# Altium project Mega to Connector.PrjPcb
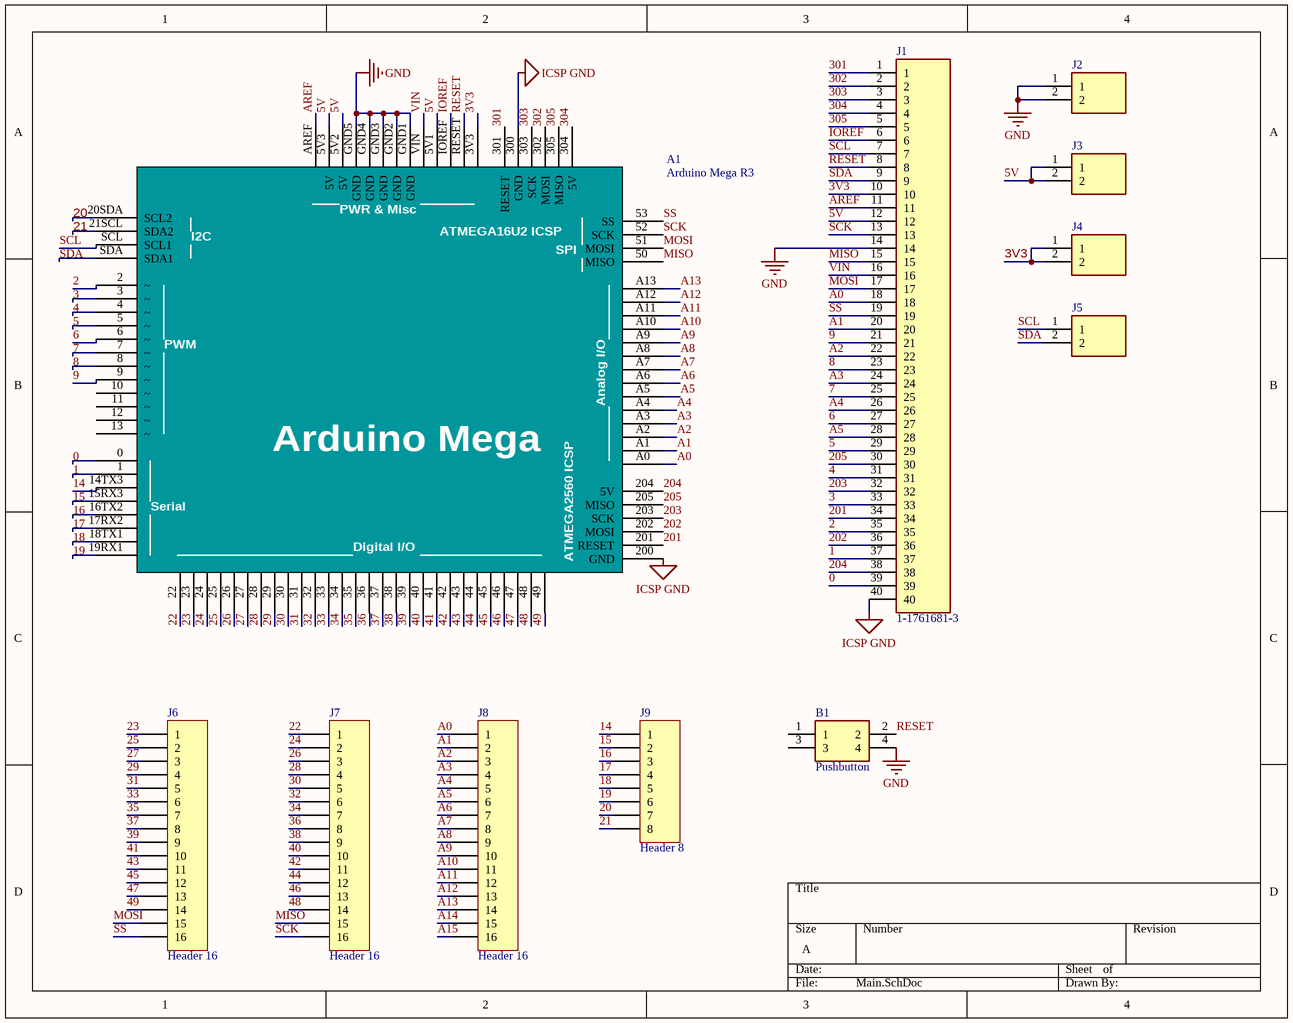
[diagram p0: Main.SchDoc]
1 sheet, 11 parts. Net scope: global (net labels, ports and power ports of the same name join across sheets).
Board file: Main.PcbDoc

## Sheet Main.SchDoc
size A; SheetNumber: 1; SheetTotal: 1

### Parts
A1  Arduino Mega R3  [Arduino Mega]
B1  Pushbutton  [FSM4JH]
J1  1-1761681-3  [TE_1-1761681-3]
J2  TB002-500-02BE  [TB00250002BE]  (value not drawn)
J3  TB002-500-02BE  [TB00250002BE]  (value not drawn)
J4  TB002-500-02BE  [TB00250002BE]  (value not drawn)
J5  TB002-500-02BE  [TB00250002BE]  (value not drawn)
J6  Header 16  [HDR1X16]
J7  Header 16  [HDR1X16]
J8  Header 16  [HDR1X16]
J9  Header 8  [HDR1X8]

### Nets
GND: A1.GND1(GND) A1.GND2(GND) A1.GND3(GND) A1.GND4(GND) A1.GND5(GND) B1.4 J1.14 J2.1 J2.2
ICSP GND: A1.200(GND) A1.300(GND) J1.40
0: A1.0 J1.39
1: A1.1 J1.37
2: A1.2 J1.35
3: A1.3 J1.33
3V3: A1.3V3 J1.10 J4.1 J4.2
4: A1.4 J1.31
5: A1.5 J1.29
5V: A1.5V1 A1.5V2(5V) A1.5V3(5V) J1.12 J3.1 J3.2
6: A1.6 J1.27
7: A1.7 J1.25
8: A1.8 J1.23
9: A1.9 J1.21
14: A1.14TX3 J9.1
15: A1.15RX3 J9.2
16: A1.16TX2 J9.3
17: A1.17RX2 J9.4
18: A1.18TX1 J9.5
19: A1.19RX1 J9.6
20: A1.20SDA(SCL2) J9.7
21: A1.21SCL(SDA2) J9.8
22: A1.22 J7.1
23: A1.23 J6.1
24: A1.24 J7.2
25: A1.25 J6.2
26: A1.26 J7.3
27: A1.27 J6.3
28: A1.28 J7.4
29: A1.29 J6.4
30: A1.30 J7.5
31: A1.31 J6.5
32: A1.32 J7.6
33: A1.33 J6.6
34: A1.34 J7.7
35: A1.35 J6.7
36: A1.36 J7.8
37: A1.37 J6.8
38: A1.38 J7.9
39: A1.39 J6.9
40: A1.40 J7.10
41: A1.41 J6.10
42: A1.42 J7.11
43: A1.43 J6.11
44: A1.44 J7.12
45: A1.45 J6.12
46: A1.46 J7.13
47: A1.47 J6.13
48: A1.48 J7.14
49: A1.49 J6.14
201: A1.201(RESET) J1.34
202: A1.202(MOSI) J1.36
203: A1.203(SCK) J1.32
204: A1.204(5V) J1.38
205: A1.205(MISO) J1.30
301: A1.301(RESET) J1.1
302: A1.302(MOSI) J1.2
303: A1.303(SCK) J1.3
304: A1.304(5V) J1.4
305: A1.305(MISO) J1.5
A0: A1.A0 J1.18 J8.1
A1: A1.A1 J1.20 J8.2
A2: A1.A2 J1.22 J8.3
A3: A1.A3 J1.24 J8.4
A4: A1.A4 J1.26 J8.5
A5: A1.A5 J1.28 J8.6
A6: A1.A6 J8.7
A7: A1.A7 J8.8
A8: A1.A8 J8.9
A9: A1.A9 J8.10
A10: A1.A10 J8.11
A11: A1.A11 J8.12
A12: A1.A12 J8.13
A13: A1.A13 J8.14
A14: J8.15
A15: J8.16
AREF: A1.AREF J1.11
IOREF: A1.IOREF J1.6
MISO: A1.50(MISO) J1.15 J7.15
MOSI: A1.51(MOSI) J1.17 J6.15
RESET: A1.RESET B1.2 J1.8
SCK: A1.52(SCK) J1.13 J7.16
SCL: A1.SCL(SCL1) J1.7 J5.1
SDA: A1.SDA(SDA1) J1.9 J5.2
SS: A1.53(SS) J1.19 J6.16
VIN: A1.VIN J1.16

Not connected (* = marked no-connect by the designer): A1 10(~) 11(~) 12(~) 13(~); B1 1 3

### Notes on the sheet
- (in symbol Arduino Mega) PWR & Misc; ATMEGA16U2 ICSP; I2C; SPI; PWM; Analog I/O; ATMEGA2560 ICSP; Serial; Digital I/O

### Library data of the parts
A1 = Arduino Mega
B1 = Pushbutton: Switch; Manufacturer_Name: TE Connectivity; Manufacturer_Part_Number: FSM2JAH; Datasheet Link: http://www.te.com/commerce/DocumentDelivery/DDEController?Action=showdoc&DocId=Customer+Drawing%7F1825910%7FC9%7Fpdf%7FEnglish%7FENG_CD_1825910_C9.pdf%7F1825910-3; Mouser Part Number: 506-FSM2JAH; Mouser Price/Stock: https://www.mouser.co.uk/ProductDetail/TE-Connectivity-PB/FSM2JAH?qs=Of7OaoM7rsH02ckr%252BGLHNA%3D%3D
J1 = 1-1761681-3: IDC LOW PRO HDR 50P VERT HT BLACK; Package: None; Price: None; Value: *; MP: 1-1761681-3; Availability: Unavailable
J2-J5 = TB002-500-02BE: Connector; Manufacturer_Name: CUI Devices; Datasheet Link: https://eu.mouser.com/datasheet/2/670/tb002_500-1550579.pdf; Height: 10.4mm; Manufacturer_Part_Number: TB002-500-02BE; Mouser Part Number: 490-TB002-500-02BE; Mouser Price/Stock: https://www.mouser.co.uk/ProductDetail/CUI-Devices/TB002-500-02BE?qs=vLWxofP3U2x9716kcgva%2Fw%3D%3D; Arrow Part Number: TB002-500-02BE; Arrow Price/Stock: https://www.arrow.com/en/products/tb002-500-02be/cui-devices?region=nac
J6-J8 = Header 16: Header, 16-Pin; LatestRevisionDate: 17-Jul-2002; LatestRevisionNote: Re-released for DXP Platform.; Publisher: Altium Limited
J9 = Header 8: Header, 8-Pin; LatestRevisionDate: 17-Jul-2002; LatestRevisionNote: Re-released for DXP Platform.; Publisher: Altium Limited